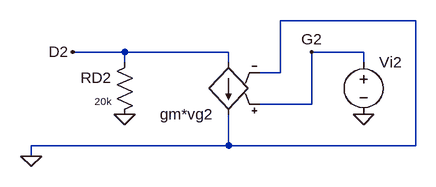
[diagram p0: schematic DifferentialAmplifierSmallSignalPiSingle2VID.asc]
DifferentialAmplifierSmallSignalPiSingle2VID.asc, the LTspice schematic file:
Version 4
SHEET 1 1156 680
WIRE 1152 -400 944 -400
WIRE 704 -352 624 -352
WIRE 864 -352 704 -352
WIRE 1072 -352 992 -352
WIRE 704 -336 704 -352
WIRE 864 -336 864 -352
WIRE 1072 -336 1072 -352
WIRE 944 -320 944 -400
WIRE 944 -320 912 -320
WIRE 992 -272 992 -352
WIRE 992 -272 912 -272
WIRE 864 -208 864 -256
WIRE 864 -208 560 -208
WIRE 1152 -208 1152 -400
WIRE 1152 -208 864 -208
WIRE 560 -192 560 -208
FLAG 1072 -256 0
FLAG 624 -352 D2
FLAG 704 -256 0
FLAG 992 -352 G2
FLAG 560 -192 0
SYMBOL voltage 1072 -352 R0
WINDOW 3 24 96 Invisible 2
SYMATTR InstName Vi2
SYMBOL res 720 -352 M0
WINDOW 3 36 76 Left 1
SYMATTR Value 20k
SYMATTR InstName RD2
SYMBOL g 864 -240 R180
WINDOW 3 24 96 Invisible 2
SYMATTR InstName gm*vg2

The netlist it stands for:
* DifferentialAmplifierSmallSignalPiSingle2VID.asc
Vi2 G2 0 V
RD2 D2 0 20k
gm*vg2 D2 0 G2 0 G
.backanno
.end